# Altium schematic sheet DMA.SchDoc
size A3; SheetNumber: 1; SheetTotal: 1
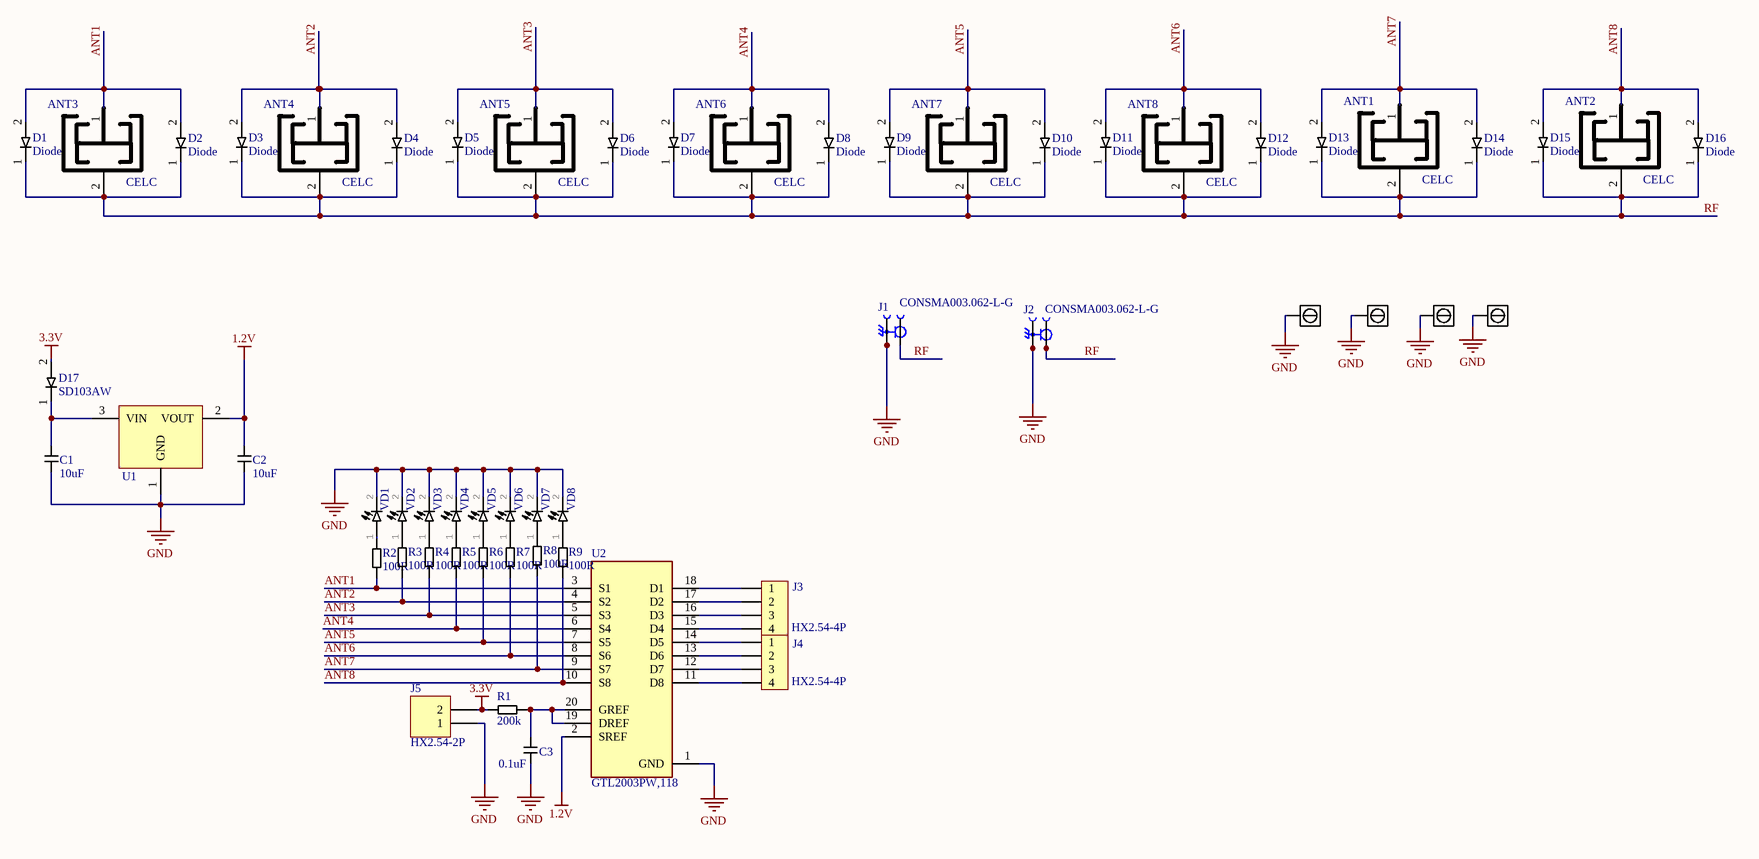
[diagram p0: DMA.SchDoc]

## Parts
1  SMTSO_STAND_M3  [M3x1]  (value not drawn)
2  SMTSO_STAND_M3  [M3x1]  (value not drawn)
3  SMTSO_STAND_M3  [M3x1]  (value not drawn)
4  SMTSO_STAND_M3  [M3x1]  (value not drawn)
ANT1  CELC  [PCBComponent_1]
ANT2  CELC  [PCBComponent_1]
ANT3  CELC  [PCBComponent_1]
ANT4  CELC  [PCBComponent_1]
ANT5  CELC  [PCBComponent_1]
ANT6  CELC  [PCBComponent_1]
ANT7  CELC  [PCBComponent_1]
ANT8  CELC  [PCBComponent_1]
C1  10uF  [0603_MD_CAPC1608X04N]
C2  10uF  [0603_MD_CAPC1608X04N]
C3  0.1uF  [0603_MD_CAPC1608X04N]
D1  Diode  [SOD123_MD_DIOM2615X12N]
D2  Diode  [SOD123_MD_DIOM2615X12N]
D3  Diode  [SOD123_MD_DIOM2615X12N]
D4  Diode  [SOD123_MD_DIOM2615X12N]
D5  Diode  [SOD123_MD_DIOM2615X12N]
D6  Diode  [SOD123_MD_DIOM2615X12N]
D7  Diode  [SOD123_MD_DIOM2615X12N]
D8  Diode  [SOD123_MD_DIOM2615X12N]
D9  Diode  [SOD123_MD_DIOM2615X12N]
D10  Diode  [SOD123_MD_DIOM2615X12N]
D11  Diode  [SOD123_MD_DIOM2615X12N]
D12  Diode  [SOD123_MD_DIOM2615X12N]
D13  Diode  [SOD123_MD_DIOM2615X12N]
D14  Diode  [SOD123_MD_DIOM2615X12N]
D15  Diode  [SOD123_MD_DIOM2615X12N]
D16  Diode  [SOD123_MD_DIOM2615X12N]
D17  SD103AW  [SOD123_MD_DIOM2615X12N]
J1  CONSMA003.062-L-G  [TE_CONSMA003.062-L-G]
J2  CONSMA003.062-L-G  [TE_CONSMA003.062-L-G]
J3  HX2.54-4P  [JST_S4B-XH-A(LF)(SN)]
J4  HX2.54-4P  [JST_S4B-XH-A(LF)(SN)]
J5  HX2.54-2P  [JST_S2B-XH-A(LF)(SN)]
R1  200k  [0805_MD_RESC2012X06N]
R2  100R  [0805_MD_RESC2012X06N]
R3  100R  [0805_MD_RESC2012X06N]
R4  100R  [0805_MD_RESC2012X06N]
R5  100R  [0805_MD_RESC2012X06N]
R6  100R  [0805_MD_RESC2012X06N]
R7  100R  [0805_MD_RESC2012X06N]
R8  100R  [0805_MD_RESC2012X06N]
R9  100R  [0805_MD_RESC2012X06N]
U1  AMS1117-3.3  [SOT223_3_HD_SOT230P700X180-4L]  (value not drawn)
U2  GTL2003PW,118  [SOP65P640X110-20N]
VD1  LED  [D0805]  (value not drawn)
VD2  LED  [D0805]  (value not drawn)
VD3  LED  [D0805]  (value not drawn)
VD4  LED  [D0805]  (value not drawn)
VD5  LED  [D0805]  (value not drawn)
VD6  LED  [D0805]  (value not drawn)
VD7  LED  [D0805]  (value not drawn)
VD8  LED  [D0805]  (value not drawn)

## Nets
1.2V: C2.1 U1.2(VOUT) U2.2(SREF)
3.3V: D17.2(A) J5.2 R1.1
GND: 1.1 2.1 3.1 4.1 C1.2 C2.2 C3.2 J1.2(SH) J1.3(SH) J1.4(SH) J1.5(SH) J2.2(SH) J2.3(SH) J2.4(SH) J2.5(SH) J5.1 U1.1(GND) U2.1(GND) VD1.2(C) VD2.2(C) VD3.2(C) VD4.2(C) VD5.2(C) VD6.2(C) VD7.2(C) VD8.2(C)
ANT1: ANT3.1(RF) D1.2(A) D2.2(A) R2.1 U2.3(S1)
ANT2: ANT4.1(RF) D3.2(A) D4.2(A) R3.1 U2.4(S2)
ANT3: ANT5.1(RF) D5.2(A) D6.2(A) R4.1 U2.5(S3)
ANT4: ANT6.1(RF) D7.2(A) D8.2(A) R5.1 U2.6(S4)
ANT5: ANT7.1(RF) D9.2(A) D10.2(A) R6.1 U2.7(S5)
ANT6: ANT8.1(RF) D11.2(A) D12.2(A) R7.1 U2.8(S6)
ANT7: ANT1.1(RF) D13.2(A) D14.2(A) R8.1 U2.9(S7)
ANT8: ANT2.1(RF) D15.2(A) D16.2(A) R9.1 U2.10(S8)
RF: ANT1.2(GND) ANT2.2(GND) ANT3.2(GND) ANT4.2(GND) ANT5.2(GND) ANT6.2(GND) ANT7.2(GND) ANT8.2(GND) D1.1(C) D2.1(C) D3.1(C) D4.1(C) D5.1(C) D6.1(C) D7.1(C) D8.1(C) D9.1(C) D10.1(C) D11.1(C) D12.1(C) D13.1(C) D14.1(C) D15.1(C) D16.1(C) J1.1(SIG) J2.1(SIG)
NetC1_1: C1.1 D17.1(C) U1.3(VIN)
NetC3_1: C3.1 R1.2 U2.19(DREF) U2.20(GREF)
NetJ3_1: J3.1 U2.18(D1)
NetJ3_2: J3.2 U2.17(D2)
NetJ3_3: J3.3 U2.16(D3)
NetJ3_4: J3.4 U2.15(D4)
NetJ4_1: J4.1 U2.14(D5)
NetJ4_2: J4.2 U2.13(D6)
NetJ4_3: J4.3 U2.12(D7)
NetJ4_4: J4.4 U2.11(D8)
NetR2_2: R2.2 VD1.1(A)
NetR3_2: R3.2 VD2.1(A)
NetR4_2: R4.2 VD3.1(A)
NetR5_2: R5.2 VD4.1(A)
NetR6_2: R6.2 VD5.1(A)
NetR7_2: R7.2 VD6.1(A)
NetR8_2: R8.2 VD7.1(A)
NetR9_2: R9.2 VD8.1(A)

## Library data of the parts
1-4 = SMTSO_STAND_M3: GateName_1: PART_1; SymbolName_1: SMTSO_STAND_M3; LibraryName: SMTSO; DeviceSetName: SMTSO_STAND_M3; Package: SMTJ_stand_m3_NEW; CompCode: *
C1 C2 = C: Capacitors IPC; CompCode: 6915
C3 = C: Capacitors IPC; CompCode: *
D1-D16 = Diode: SMD diode; CompCode: *
D17 = Diode: SMD diode; CompCode: 453
J3 J4 = HX2.54-4P: JST HX 2.54 4P; CompCode: 1615
J5 = HX2.54-2P: JST HX 2.54 2P; CompCode: 395
R1-R9 = R: Resistors IPC; CompCode: *
U1 = AMS1117-3.3: 800mA LOW DROPOUT VOLTAGE REGULATOR; CompCode: 3597; Datasheet: Q:\Software\Altium\Datasheets\AMS1117.pdf
U2 = GTL2003PW,118: Voltage Level Translator Bidirectional 1 Circuit 8 Channel 20-TSSOP; MF: NXP USA; Digi-Key_Part_Number: 568-12295-1-ND; Check_prices: https://www.snapeda.com/parts/GTL2003PW,118/NXP%20USA%20Inc./view-part/481710/?ref=eda; Value: *; MP: GTL2003PW,118; SnapEDA_Link: https://www.snapeda.com/parts/GTL2003PW,118/NXP%20USA%20Inc./view-part/481710/?ref=snap; Purchase-URL: https://pricing.snapeda.com/search/part/GTL2003PW,118/?ref=eda; Package: TSSOP-20 NXP Semiconductors
VD1-VD8 = LED: GateName_1: PART_1; SymbolName_1: LED_1204_R/A; DeviceSetName: LED_3MM_DIP_BLUE; LibraryName: LED; Package: LED_3mm_DIP_Blue; CompCode: *
J1 J2 = CONSMA003.062-L-G: Package: None; Price: None; Value: *; MP: CONSMA003.062-L-G; Availability: Unavailable